# EAGLE design MOTOR SIDE PCB (EAGLE 9.6.2)
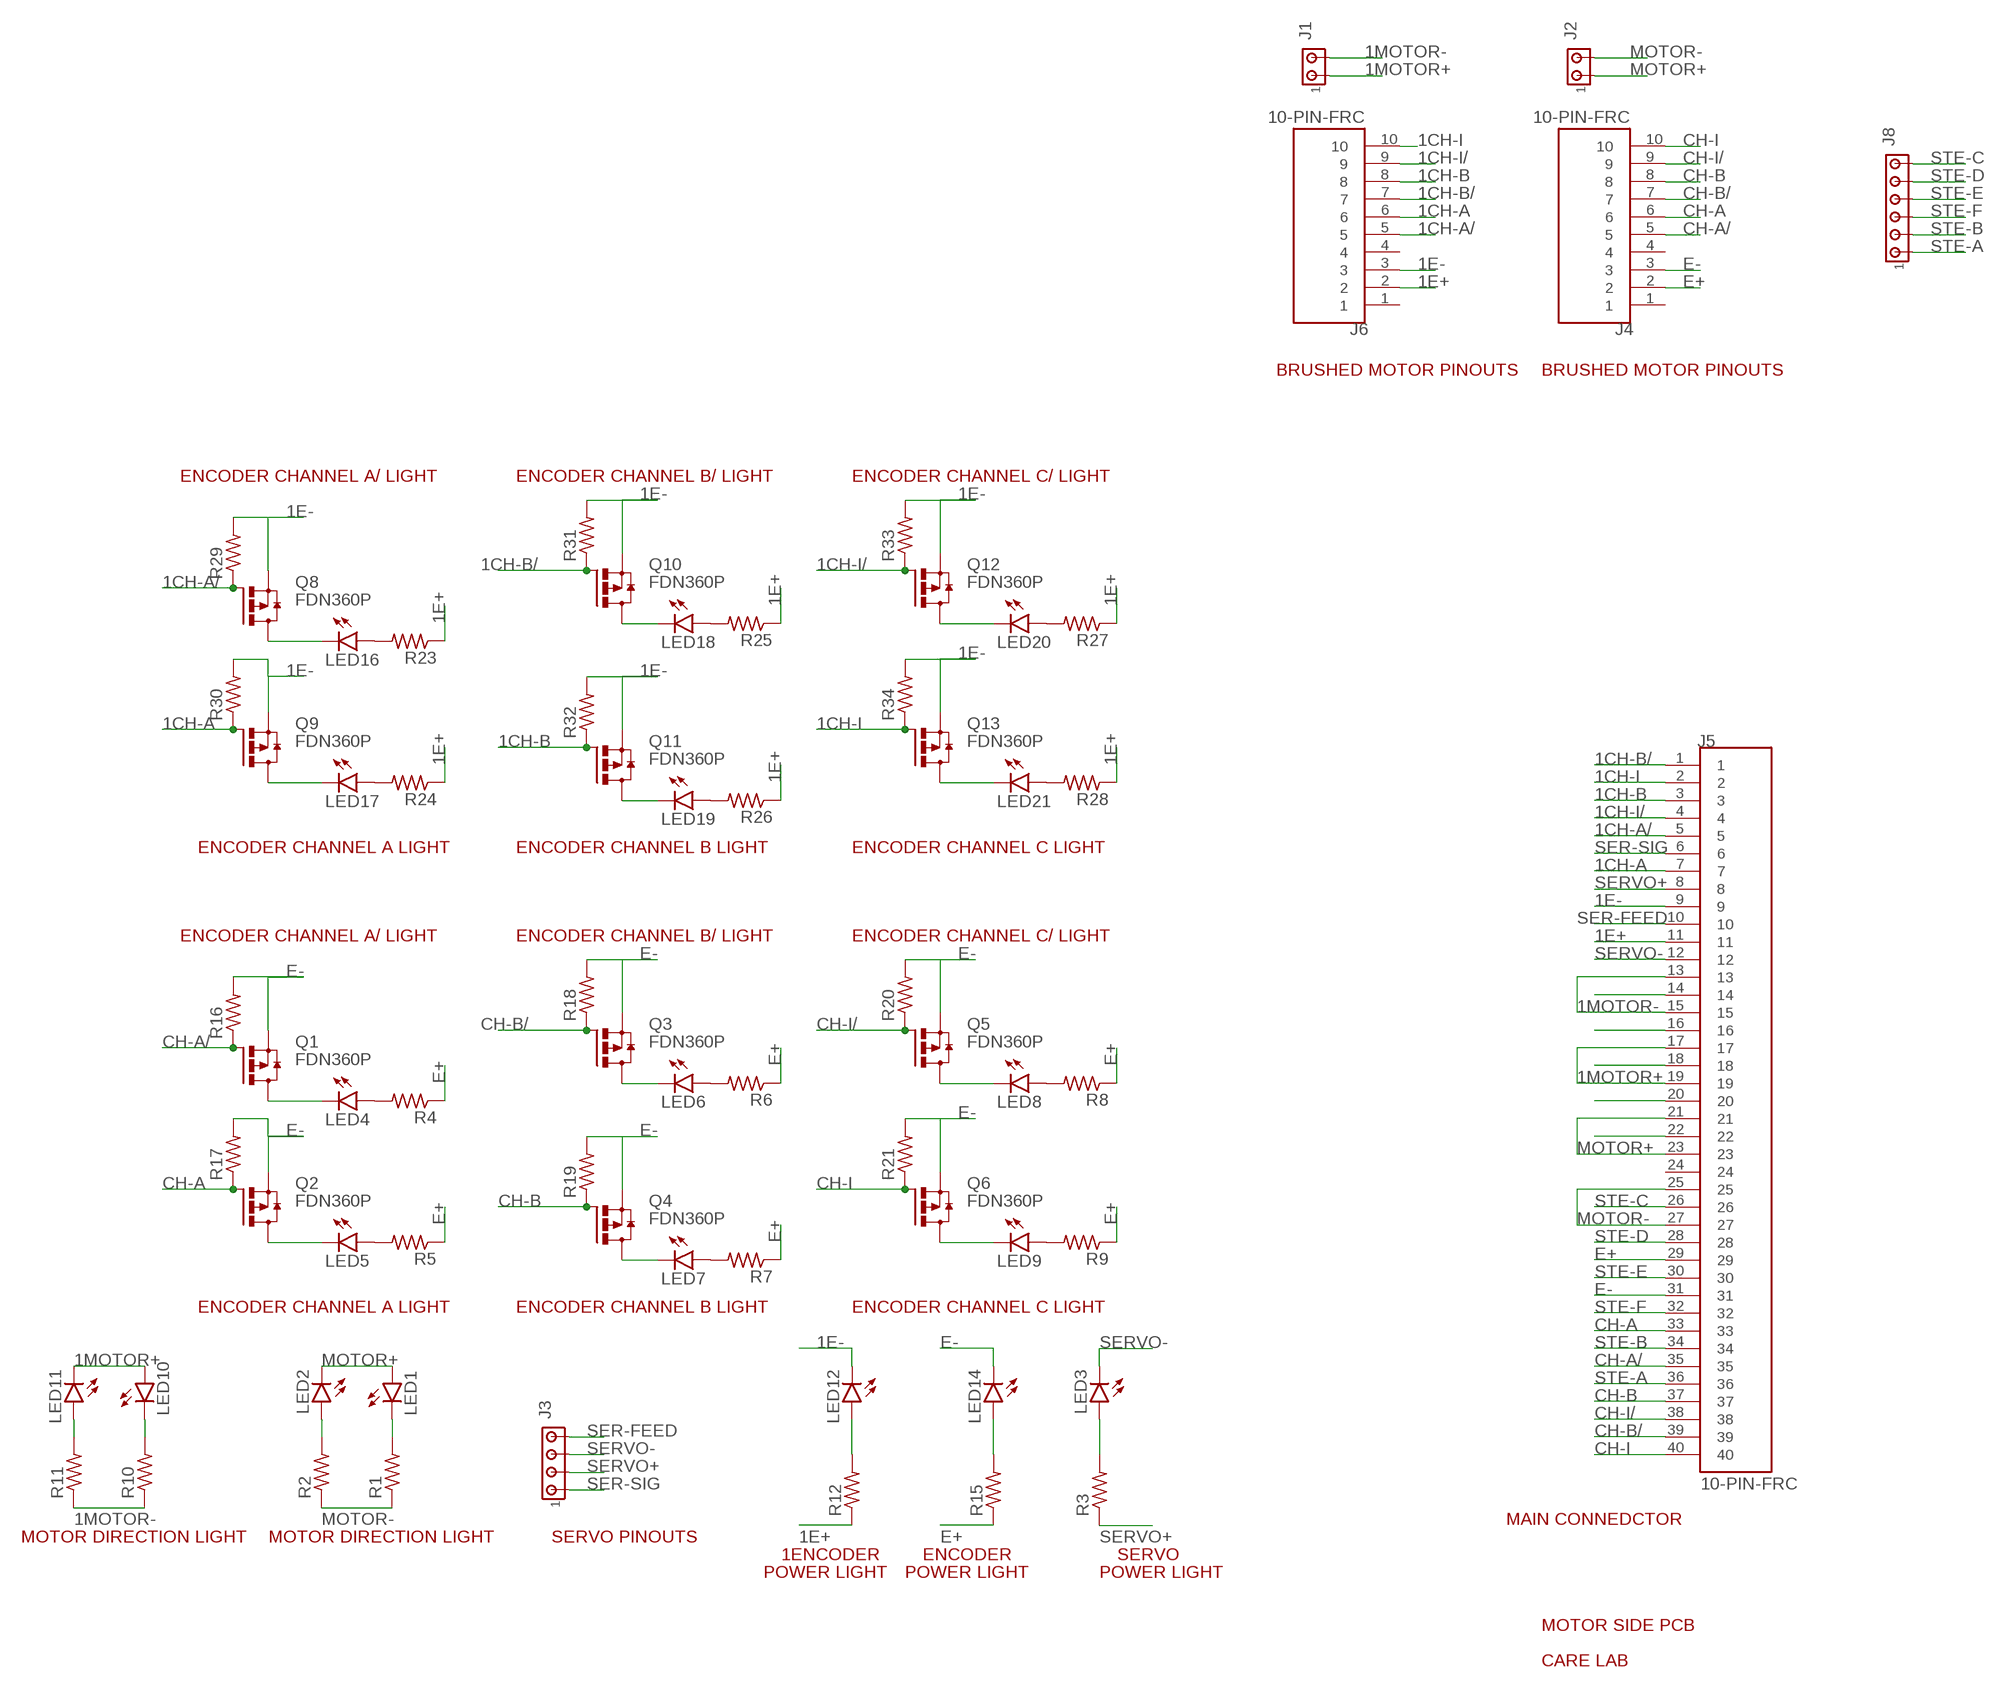
[diagram p0: schematic, sheet 1]

## Parts
J1  MTA02-100  [10X02MTA]
J2  MTA02-100  [10X02MTA]
J3  MTA04-100  [10X04MTA]
J4  10-PIN-FRC  [TE_2-1761603-3]
J5  10-PIN-FRC  [TE_3-1761605-3]
J6  10-PIN-FRC  [TE_2-1761603-3]
J8  MTA06-100  [10X06MTA]
LED1  LEDCHIP-LED0805  [CHIP-LED0805]
LED2  LEDCHIP-LED0805  [CHIP-LED0805]
LED3  LEDCHIP-LED0805  [CHIP-LED0805]
LED4  LEDCHIP-LED0805  [CHIP-LED0805]
LED5  LEDCHIP-LED0805  [CHIP-LED0805]
LED6  LEDCHIP-LED0805  [CHIP-LED0805]
LED7  LEDCHIP-LED0805  [CHIP-LED0805]
LED8  LEDCHIP-LED0805  [CHIP-LED0805]
LED9  LEDCHIP-LED0805  [CHIP-LED0805]
LED10  LEDCHIP-LED0805  [CHIP-LED0805]
LED11  LEDCHIP-LED0805  [CHIP-LED0805]
LED12  LEDCHIP-LED0805  [CHIP-LED0805]
LED14  LEDCHIP-LED0805  [CHIP-LED0805]
LED16  LEDCHIP-LED0805  [CHIP-LED0805]
LED17  LEDCHIP-LED0805  [CHIP-LED0805]
LED18  LEDCHIP-LED0805  [CHIP-LED0805]
LED19  LEDCHIP-LED0805  [CHIP-LED0805]
LED20  LEDCHIP-LED0805  [CHIP-LED0805]
LED21  LEDCHIP-LED0805  [CHIP-LED0805]
Q1  FDN360P  [SUPER-SOT3]
Q2  FDN360P  [SUPER-SOT3]
Q3  FDN360P  [SUPER-SOT3]
Q4  FDN360P  [SUPER-SOT3]
Q5  FDN360P  [SUPER-SOT3]
Q6  FDN360P  [SUPER-SOT3]
Q8  FDN360P  [SUPER-SOT3]
Q9  FDN360P  [SUPER-SOT3]
Q10  FDN360P  [SUPER-SOT3]
Q11  FDN360P  [SUPER-SOT3]
Q12  FDN360P  [SUPER-SOT3]
Q13  FDN360P  [SUPER-SOT3]
R1  R-US_R0603  [R0603]
R2  R-US_R0603  [R0603]
R3  R-US_R0603  [R0603]
R4  R-US_R0603  [R0603]
R5  R-US_R0603  [R0603]
R6  R-US_R0603  [R0603]
R7  R-US_R0603  [R0603]
R8  R-US_R0603  [R0603]
R9  R-US_R0603  [R0603]
R10  R-US_R0603  [R0603]
R11  R-US_R0603  [R0603]
R12  R-US_R0603  [R0603]
R15  R-US_R0603  [R0603]
R16  R-US_R0603  [R0603]
R17  R-US_R0603  [R0603]
R18  R-US_R0603  [R0603]
R19  R-US_R0603  [R0603]
R20  R-US_R0603  [R0603]
R21  R-US_R0603  [R0603]
R23  R-US_R0603  [R0603]
R24  R-US_R0603  [R0603]
R25  R-US_R0603  [R0603]
R26  R-US_R0603  [R0603]
R27  R-US_R0603  [R0603]
R28  R-US_R0603  [R0603]
R29  R-US_R0603  [R0603]
R30  R-US_R0603  [R0603]
R31  R-US_R0603  [R0603]
R32  R-US_R0603  [R0603]
R33  R-US_R0603  [R0603]
R34  R-US_R0603  [R0603]

## Nets
1CH-A: J5.7 J6.6 Q9.1(G) R30.1
1CH-A/: J5.5 J6.5 Q8.1(G) R29.1
1CH-B: J5.3 J6.8 Q11.1(G) R32.1
1CH-B/: J5.1 J6.7 Q10.1(G) R31.1
1CH-I: J5.2 J6.10 Q13.1(G) R34.1
1CH-I/: J5.4 J6.9 Q12.1(G) R33.1
1E+: J5.11 J6.2 R12.1 R23.1 R24.1 R25.1 R26.1 R27.1 R28.1
1E-: J5.9 J6.3 LED12.C Q8.2(S) Q9.2(S) Q10.2(S) Q11.2(S) Q12.2(S) Q13.2(S) R29.2 R30.2 R31.2 R32.2 R33.2 R34.2
1MOTOR+: J1.1 J5.17 J5.19 LED10.A LED11.C
1MOTOR-: J1.2 J5.13 J5.15 R10.1 R11.1
CH-A: J4.6 J5.33 Q2.1(G) R17.1
CH-A/: J4.5 J5.35 Q1.1(G) R16.1
CH-B: J4.8 J5.37 Q4.1(G) R19.1
CH-B/: J4.7 J5.39 Q3.1(G) R18.1
CH-I: J4.10 J5.40 Q6.1(G) R21.1
CH-I/: J4.9 J5.38 Q5.1(G) R20.1
E+: J4.2 J5.29 R4.1 R5.1 R6.1 R7.1 R8.1 R9.1 R15.1
E-: J4.3 J5.31 LED14.C Q1.2(S) Q2.2(S) Q3.2(S) Q4.2(S) Q5.2(S) Q6.2(S) R16.2 R17.2 R18.2 R19.2 R20.2 R21.2
MOTOR+: J2.1 J5.21 J5.23 LED1.A LED2.C
MOTOR-: J2.2 J5.25 J5.27 R1.1 R2.1
N$1: LED4.A R4.2
N$2: LED5.A R5.2
N$3: LED6.A R6.2
N$4: LED7.A R7.2
N$5: LED8.A R8.2
N$6: LED9.A R9.2
N$8: LED2.A R2.2
N$9: LED1.C R1.2
N$10: LED11.A R11.2
N$11: LED10.C R10.2
N$12: LED12.A R12.2
N$15: LED4.C Q1.3(D)
N$16: LED5.C Q2.3(D)
N$17: LED6.C Q3.3(D)
N$18: LED7.C Q4.3(D)
N$19: LED8.C Q5.3(D)
N$20: LED9.C Q6.3(D)
N$24: LED16.C Q8.3(D)
N$25: LED17.C Q9.3(D)
N$26: LED18.C Q10.3(D)
N$27: LED19.C Q11.3(D)
N$28: LED20.C Q12.3(D)
N$29: LED3.A R3.2
N$30: LED14.A R15.2
N$31: LED21.C Q13.3(D)
N$32: LED16.A R23.2
N$33: LED17.A R24.2
N$34: LED18.A R25.2
N$35: LED19.A R26.2
N$36: LED20.A R27.2
N$37: LED21.A R28.2
N$51: J5.14
N$53: J5.16
N$55: J5.18
N$57: J5.20
N$61: J5.22
SER-FEED: J3.4 J5.10
SER-SIG: J3.1 J5.6
SERVO+: J3.2 J5.8 R3.1
SERVO-: J3.3 J5.12 LED3.C
STE-A: J5.36 J8.1
STE-B: J5.34 J8.2
STE-C: J5.26 J8.6
STE-D: J5.28 J8.5
STE-E: J5.30 J8.4
STE-F: J5.32 J8.3
Unconnected: J4.1 J4.4 J5.24 J6.1 J6.4

## Notes on the sheet
- BRUSHED MOTOR PINOUTS | BRUSHED MOTOR PINOUTS
- ENCODER CHANNEL A/ LIGHT | ENCODER CHANNEL B/ LIGHT | ENCODER CHANNEL C/ LIGHT
- ENCODER CHANNEL A LIGHT | ENCODER CHANNEL B LIGHT | ENCODER CHANNEL C LIGHT
- ENCODER CHANNEL A/ LIGHT | ENCODER CHANNEL B/ LIGHT | ENCODER CHANNEL C/ LIGHT
- ENCODER CHANNEL A LIGHT | ENCODER CHANNEL B LIGHT | ENCODER CHANNEL C LIGHT
- MAIN CONNEDCTOR
- MOTOR DIRECTION LIGHT | MOTOR DIRECTION LIGHT | SERVO PINOUTS
- 1ENCODER | ENCODER | SERVO
- POWER LIGHT | POWER LIGHT | POWER LIGHT
- MOTOR SIDE PCB
- CARE LAB

## Library data of the parts
J1 J2 = con-amp:MTA02-100: AMP connector
J3 = con-amp:MTA04-100: AMP connector
J4 J6 = 2-1761603-3:10-PIN-FRC: IDC LOW PRO HDR 20P VERT BLACK Check availability <https://pricing.snapeda.com/parts/2-1761603-3/TE%20Connectivity/view-part?ref=eda>; AVAILABILITY: In Stock; COMMENT: 2-1761603-3; DESCRIPTION: Header, Pin, Idc, Amp-Latch, 10 Pos, Low Profile, Pcb, Vertical, Blue; EU_ROHS_COMPLIANCE: Compliant; MF: TE Connectivity; MP: 2-1761603-3; PACKAGE: None; PRICE: None; PURCHASE-URL: https://pricing.snapeda.com/search/part/2-1761603-3/?ref=eda
J5 = 3-1761605-3:10-PIN-FRC: IDC LOW PRO HDR 10P RA BLACK Check availability <https://pricing.snapeda.com/parts/3-1761605-3/TE%20Connectivity/view-part?ref=eda>; AVAILABILITY: In Stock; COMMENT: 3-1761605-3; DESCRIPTION: IDC LOW PRO HDR 40P RA BLUE; EU_ROHS_COMPLIANCE: Compliant; MF: TE Connectivity; MP: 3-1761605-3; PACKAGE: None; PRICE: None; PURCHASE-URL: https://pricing.snapeda.com/search/part/3-1761605-3/?ref=eda
J8 = con-amp:MTA06-100: AMP connector Connection corrected 2014-09-19
LED1-LED12 LED14 LED16-LED21 = led:LED: LED OSRAM: - CHIPLED LG R971, LG N971, LY N971, LG Q971, LY Q971, LO R971, LY R971 LH N974, LH R974 LS Q976, LO Q976, LY Q976 LO Q996 - Hyper CHIPLED LW Q18S LB Q993, LB Q99A, LB R99A - SideLED LS A670, LO A670, LY A670, LG A670, LP A670 LB A673, LV A673, LT A673, LW A673 LH A674 LY A675 LS A676, LA A676, LO A676, LY A676, LW A676 LS A679, LY A679, LG A679 - Hyper Micro SIDELED® LS Y876, LA Y876, LO Y876, LY Y876 LT Y87S - SmartLED LW L88C, LW L88S LB L89C, LB L89S, LG L890 LS L89K, LO L89K, LY L89K LS L896, LA L896, LO L896, LY L896 - TOPLED LS T670, LO T670, LY T670, LG T670, LP T670 LSG T670, LSP T670, LSY T670, LOP T670, LYG T670 LG T671, LOG T671, LSG T671 LB T673, LV T673, LT T673, LW T673 LH T674 LS T676, LA T676, LO T676, LY T676, LB T676, LH T676, LSB T676, LW T676 LB T67C, LV T67C, LT T67C, LS T67K, LO T67K, LY T67K, LW E67C LS E67B, LA E67B, LO E67B, LY E67B, LB E67C, LV E67C, LT E67C LW T67C LS T679, LY T679, LG T679 LS T770, LO T770, LY T770, LG T770, LP T770 LB T773, LV T773, LT T773, LW T773 LH T774 LS E675, LA E675, LY E675, LS T675 LS T776, LA T776, LO T776, LY T776, LB T776 LHGB T686 LT T68C, LB T68C - Hyper Mini TOPLED® LB M676 - Mini TOPLED Santana® LG M470 LS M47K, LO M47K, LY M47K Source: http://www.osram.convergy.de LUXEON: - LUMILED® LXK2-PW12-R00, LXK2-PW12-S00, LXK2-PW14-U00, LXK2-PW14-V00 LXK2-PM12-R00, LXK2-PM12-S00, LXK2-PM14-U00 LXK2-PE12-Q00, LXK2-PE12-R00, LXK2-PE12-S00, LXK2-PE14-T00, LXK2-PE14-U00 LXK2-PB12-K00, LXK2-PB12-L00, LXK2-PB12-M00, LXK2-PB14-N00, LXK2-PB14-P00, LXK2-PB14-Q00 LXK2-PR12-L00, LXK2-PR12-M00, LXK2-PR14-Q00, LXK2-PR14-R00 LXK2-PD12-Q00, LXK2-PD12-R00, LXK2-PD12-S00 LXK2-PH12-R00, LXK2-PH12-S00 LXK2-PL12-P00, LXK2-PL12-Q00, LXK2-PL12-R00 Source: www.luxeon.com KINGBRIGHT: KA-3528ASYC Source: www.kingbright.com
Q1-Q6 Q8-Q13 = transistor-power:FDN360P: Single P-Channel, PowerTrench (R) MOSFET Source: http://www.fairchildsemi.com/ds/FD/FDN360P.pdf
R1-R12 R15-R21 R23-R34 = rcl:R-US_: RESISTOR, American symbol; SPICEPREFIX: R

## Board
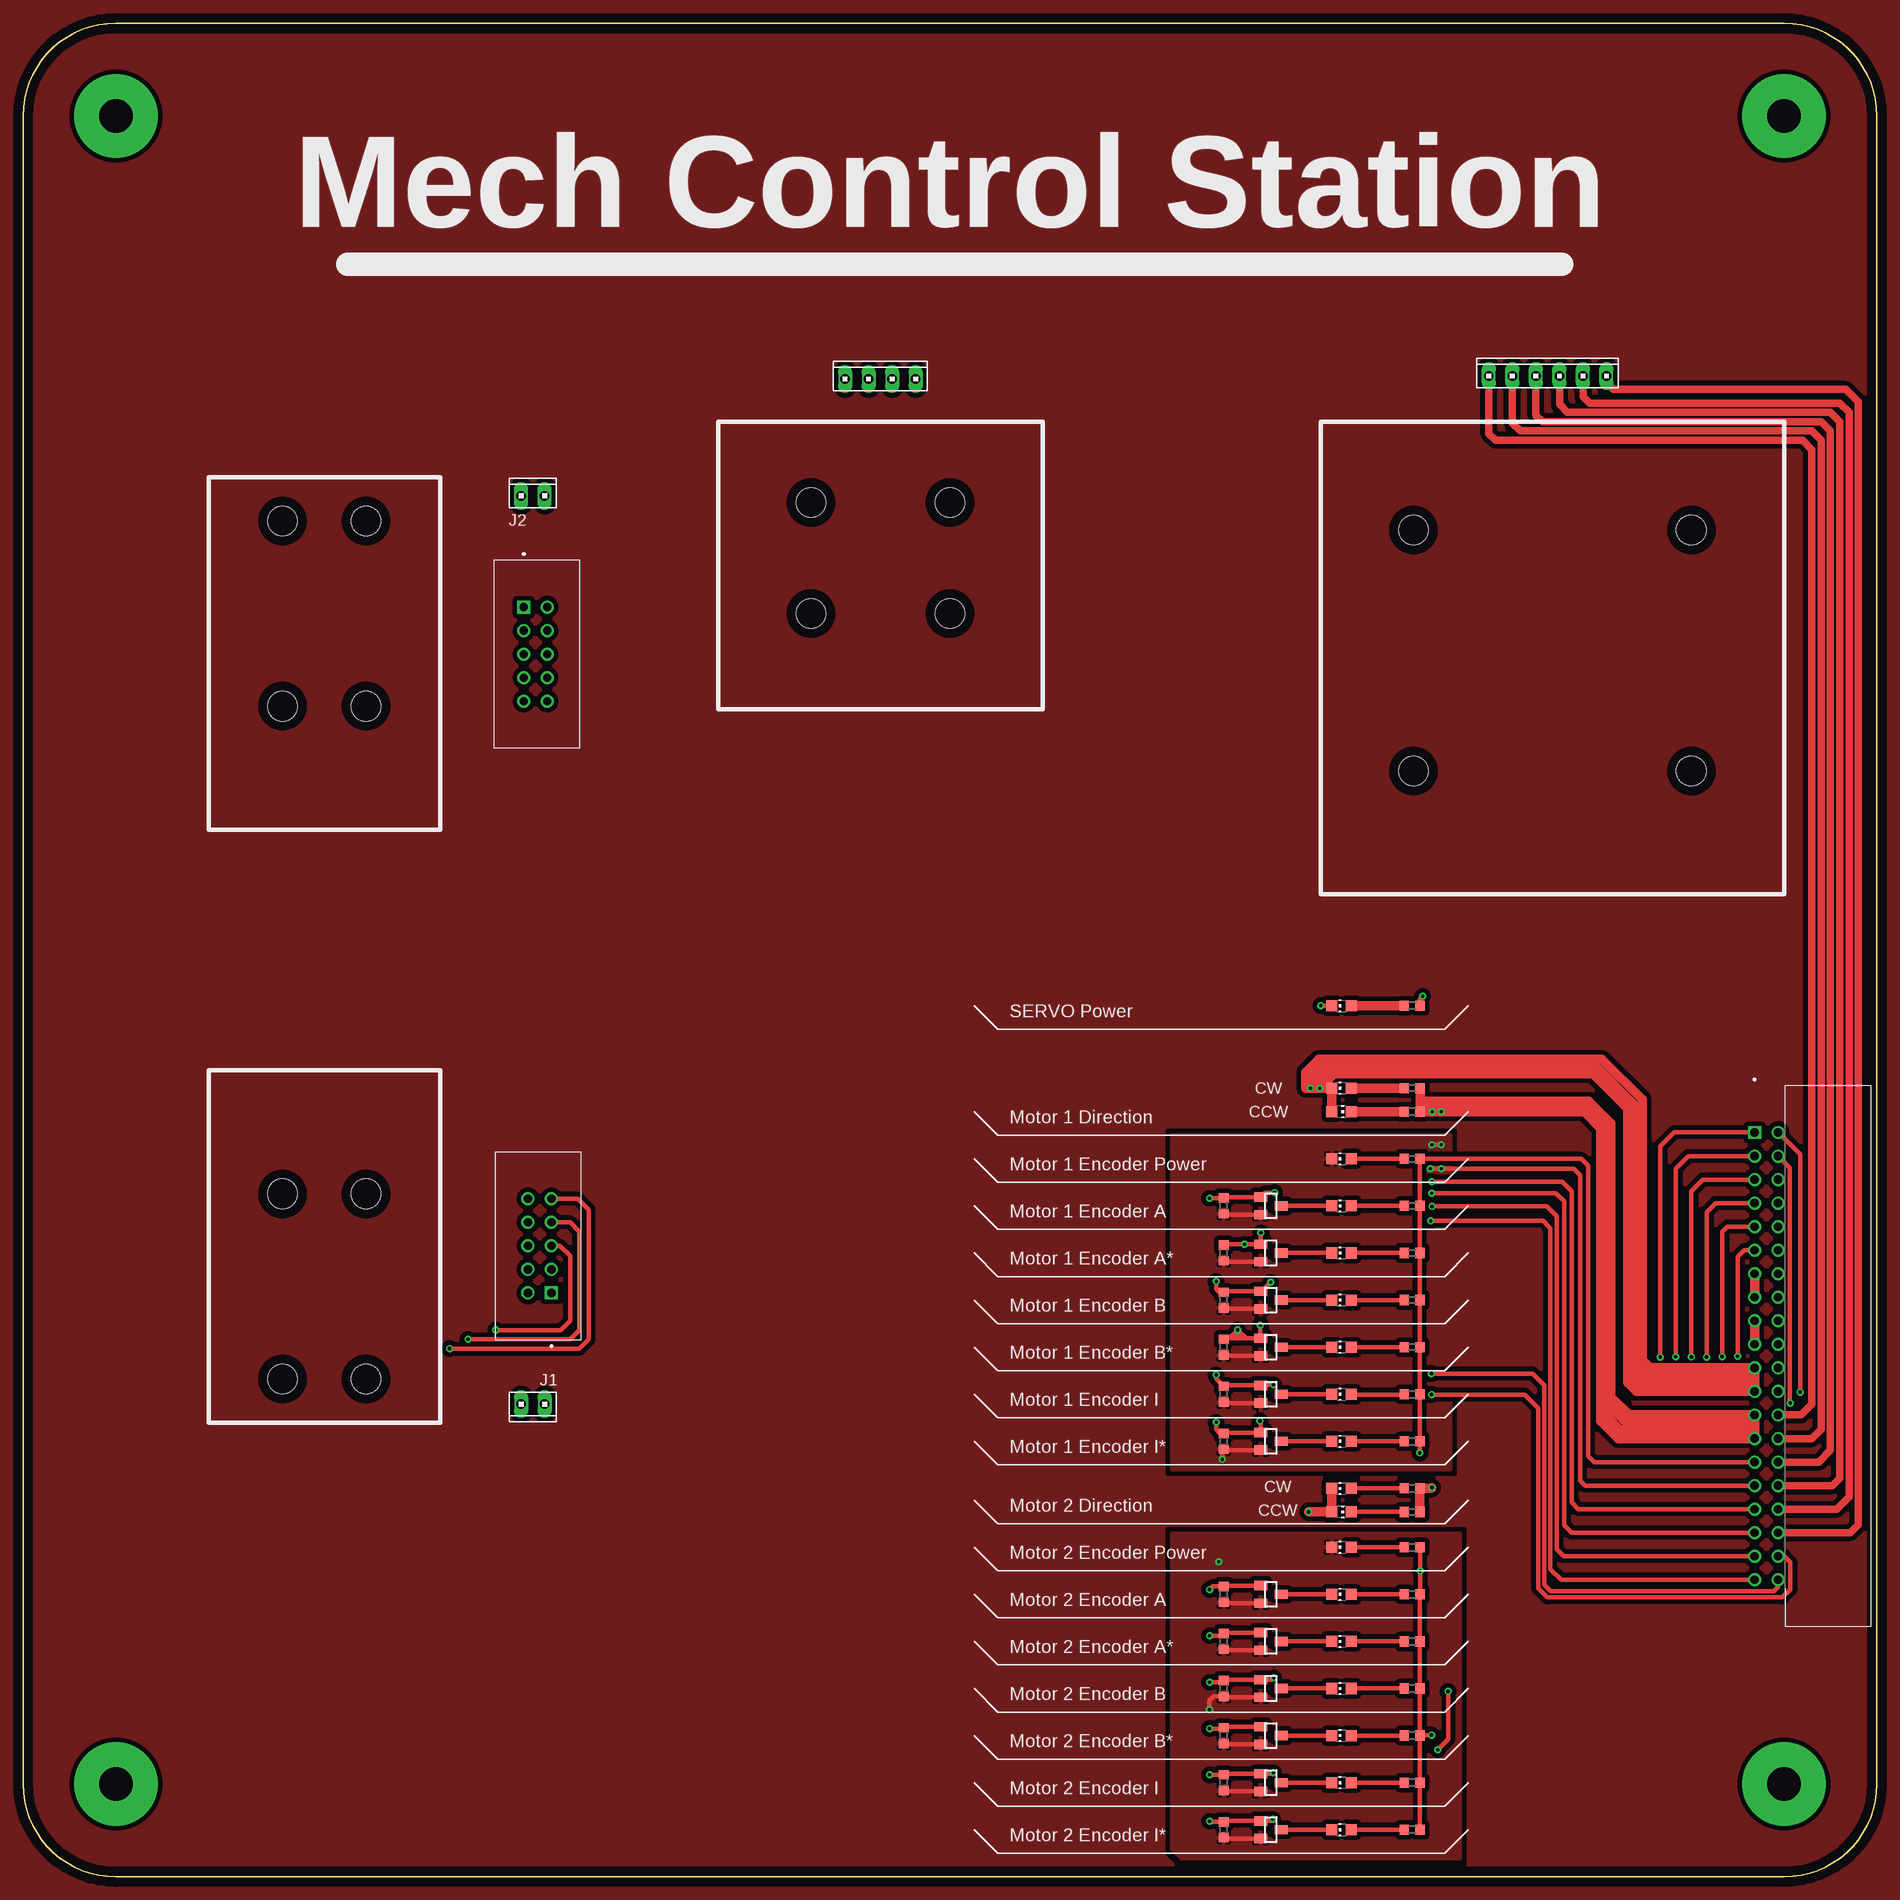
[diagram p1: board, top side]
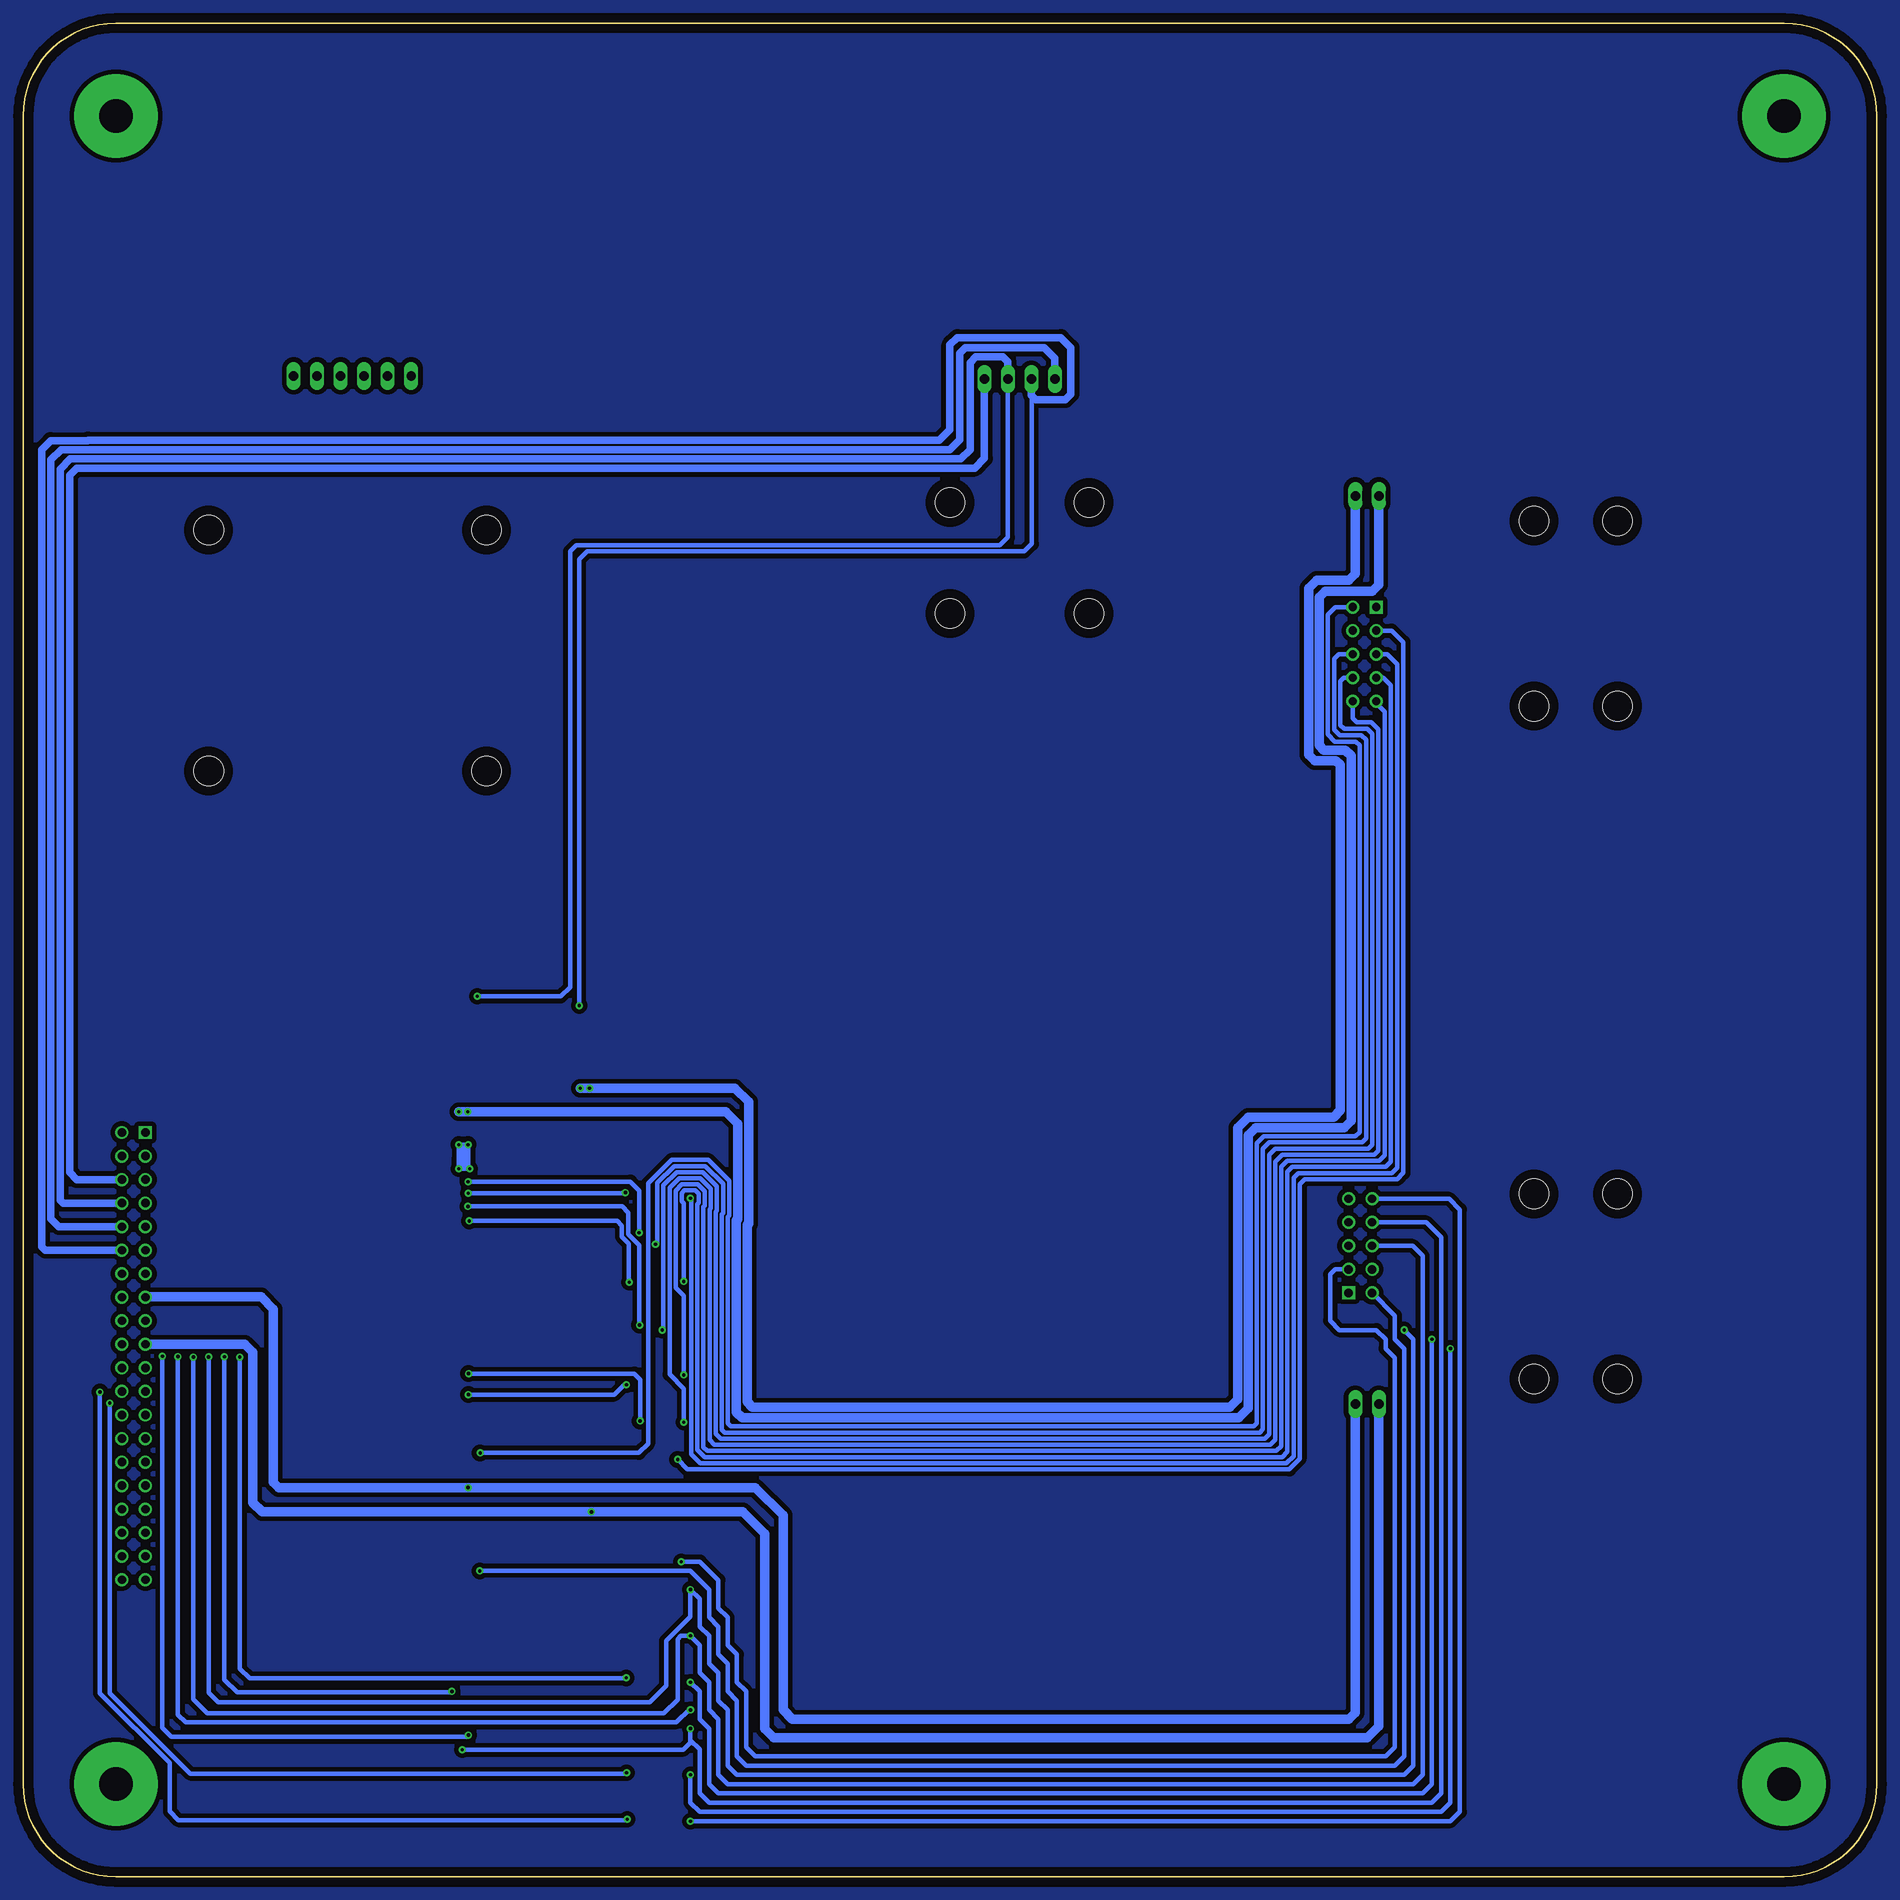
[diagram p2: board, bottom side, seen from below]

Size 200 x 200 mm. Coordinates in mm from the lower left corner, seen from the top.
Outline: 0,10 0,190 arc-90 10,200 190,200 arc-90 200,190 200,10 arc-90 190,0 10,0 arc-90 0,10
Copper layers (1*16): Top 0.035mm / dielectric 1.5mm / Bottom 0.035mm
Design rules "default *": minimum track width 6mil, minimum drill 0.35mm, track to track 6mil, track to pad 6mil, pad to pad 6mil, via to via 6mil, smd to smd 6mil, copper to edge 40mil, drill to drill 6mil, minimum pad ring 10mil, minimum via ring 8mil, stop-mask expansion 4mil, vias tented up to drill 100mil, thermal gap 10mil
Holes 3.2 mm at 28,53.7 37,53.7 37,73.7 28,73.7 28,126.3 37,126.3 37,146.3 28,146.3 85,148.3 85,136.3 100,136.3 100,148.3 150,145.3 179.98,145.3 150,119.3 179.98,119.3

### Footprints (pad centres in the part's own frame; a part is rotated, then mirrored left to right if it is on the bottom)
10X02MTA = drill 1.016 long: 1 1.27,0; 2 -1.27,0
10X04MTA = drill 1.016 long: 1 3.81,0; 2 1.27,0; 3 -1.27,0; 4 -3.81,0
TE_2-1761603-3 = drill 0.89 pad 1.24 square: 1 0,0 | drill 0.89 pad 1.24: 2 0,2.54; 3 2.54,0; 4 2.54,2.54; 5 5.08,0; 6 5.08,2.54; 7 7.62,0; 8 7.62,2.54; 9 10.16,0; 10 10.16,2.54
TE_3-1761605-3 = drill 0.89 pad 1.24 square: 1 0,0 | drill 0.89 pad 1.24: 2 0,2.54; 3 2.54,0; 4 2.54,2.54; 5 5.08,0; 6 5.08,2.54; 7 7.62,0; 8 7.62,2.54; 9 10.16,0; 10 10.16,2.54; 11 12.7,0; 12 12.7,2.54; 13 15.24,0; 14 15.24,2.54; 15 17.78,0; 16 17.78,2.54; 17 20.32,0; 18 20.32,2.54; 19 22.86,0; 20 22.86,2.54; 21 25.4,0; 22 25.4,2.54; 23 27.94,0; 24 27.94,2.54; 25 30.48,0; 26 30.48,2.54; 27 33.02,0; 28 33.02,2.54; 29 35.56,0; 30 35.56,2.54; 31 38.1,0; 32 38.1,2.54; 33 40.64,0; 34 40.64,2.54; 35 43.18,0; 36 43.18,2.54; 37 45.72,0; 38 45.72,2.54; 39 48.26,0; 40 48.26,2.54
10X06MTA = drill 1.016 long: 1 6.35,0; 2 3.81,0; 3 1.27,0; 4 -1.27,0; 5 -3.81,0; 6 -6.35,0
CHIP-LED0805 = smd 1.2 x 1.2: A 0,-1.05; C 0,1.05
SUPER-SOT3 = smd 1 x 1.4: 1 -0.95,-1.1; 2 0.95,-1.1; 3 0,1.1
R0603 = smd 1 x 1.1: 1 -0.85,0; 2 0.85,0

### Placement (x,y rotation side)
J1  55,51 180 top
J2  55,149 0 top
J3  92.49,161.6 0 top
J4  54,137 270 top
J5  186.81,80.31 270 top
J6  57,63 90 top
J8  164.48,161.94 0 top
LED1  142.24,82.55 270 top
LED2  142.24,85.09 90 top
LED3  142.24,93.98 90 top
LED4  142.24,72.39 90 top
LED5  142.24,67.31 90 top
LED6  142.24,62.23 90 top
LED7  142.24,57.15 90 top
LED8  142.24,52.07 90 top
LED9  142.24,46.99 90 top
LED10  142.24,39.37 270 top
LED11  142.24,41.91 90 top
LED12  142.24,35.56 90 top
LED14  142.24,77.47 90 top
LED16  142.24,30.48 90 top
LED17  142.24,25.4 90 top
LED18  142.24,20.32 90 top
LED19  142.24,15.24 90 top
LED20  142.24,10.16 90 top
LED21  142.24,5.08 90 top
Q1  134.62,72.39 270 top
Q2  134.62,67.31 270 top
Q3  134.62,62.23 270 top
Q4  134.62,57.15 270 top
Q5  134.62,52.07 270 top
Q6  134.62,46.99 270 top
Q8  134.62,30.48 270 top
Q9  134.62,25.4 270 top
Q10  134.62,20.32 270 top
Q11  134.62,15.24 270 top
Q12  134.62,10.16 270 top
Q13  134.62,5.08 270 top
R1  149.86,82.55 180 top
R2  149.86,85.09 180 top
R3  149.86,93.98 180 top
R4  149.86,72.39 180 top
R5  149.86,67.31 180 top
R6  149.86,62.23 180 top
R7  149.86,57.15 180 top
R8  149.86,52.07 180 top
R9  149.86,46.99 180 top
R10  149.86,39.37 180 top
R11  149.86,41.91 180 top
R12  149.86,35.56 180 top
R15  149.86,77.47 180 top
R16  129.54,72.39 270 top
R17  129.54,67.31 270 top
R18  129.54,62.23 270 top
R19  129.54,57.15 270 top
R20  129.54,52.07 270 top
R21  129.54,46.99 270 top
R23  149.86,30.48 180 top
R24  149.86,25.4 180 top
R25  149.86,20.32 180 top
R26  149.86,15.24 180 top
R27  149.86,10.16 180 top
R28  149.86,5.08 180 top
R29  129.54,30.48 270 top
R30  129.54,25.4 270 top
R31  129.54,20.32 270 top
R32  129.54,15.24 270 top
R33  129.54,10.16 270 top
R34  129.54,5.08 270 top

### Tracks (layer width: path | path; a pad name or v marks a point on that pad's centre or on a via)
1CH-A  (via drill 0.35)
  Top 0.508: Q9.1 129.64,26.35 R30.1 129.29,26 v128,26 | J5.7 182.6,72.69 181.63,71.72 v181.63,56.08
  Bottom 0.508: J6.6 50.08,68.08 49,67 49,11 50,10 124,10 125,11 125,17 126,18 126,21 127,22 127,25 v128,26 129.04,26 129.39,25.65 129.39,19.13 130.87,17.65 180.12,17.65 181.63,19.16 v181.63,56.08
1CH-A/  (via drill 0.35)
  Top 0.508: Q8.1 129.64,31.43 R29.1 128.33,31.33 v128,31 | J6.5 57.92,68.08 59,67 59,60 58,59 v51,59 | J5.5 181.23,75.23 179.99,73.99 v179.99,56.09
  Bottom 0.508: v51,59 50,58 50,12 51,11 123,11 124,12 124,18 125,19 125,22 126,23 126,26 127,27 127,30 v128,31 128,28.08 130.62,25.46 130.62,20.61 132.4,18.82 178.96,18.82 179.99,19.86 v179.99,56.09
1CH-B  (via drill 0.35)
  Top 0.508: Q11.1 129.64,16.19 R32.1 129.45,16 v128,16 | J5.3 179.66,77.77 178.28,76.39 v178.28,56.11 | v153.74,20 153.74,14.82 v152.63,13.72
  Bottom 0.508: J6.8 48.62,70.62 47,69 47,9 48,8 126,8 127,9 127,13.75 128,14.75 v128,16 128,14.49 128.77,13.72 v152.63,13.72 | v178.28,56.11 178.28,21.29 176.93,19.93 153.74,19.93 v153.74,20
1CH-B/  (via drill 0.35)
  Top 0.508: v128,21 129.37,21 R31.1 129.64,21.27 Q10.1 134.73,21.27 v134.92,21.47 | J6.7 59,70.62 60,69.62 60,59 59,58 v48,58 | J5.1 178.13,80.31 176.62,78.8 v176.62,56.08
  Bottom 0.508: v128,21 127,20 127,17 126,16 126,10 125,9 49,9 48,10 v48,58 | v176.62,56.08 176.62,22.45 175.57,21.41 134.99,21.41 v134.92,21.47
1CH-I  (via drill 0.35)
  Top 0.508: v128,6 128.07,5.93 R34.1 129.64,6.03 Q13.1 134.63,6.03 v134.82,6.21 | J5.2 191.71,77.95 v191.71,52.3
  Bottom 0.508: J6.10 46.16,73.16 45,72 45,7 46,6 v128,6 | v191.71,52.3 191.71,19.81 184.18,12.28 184.18,7.05 183.25,6.12 134.82,6.12 v134.82,6.21
1CH-I/  (via drill 0.35)
  Top 0.508: v128,11 R33.1 129.64,11.11 Q12.1 134.77,11.11 v134.9,11.24 | v46,57 60,57 61,58 61,72 59.84,73.16 J6.9 | J5.4 190.6,76.52 190.6,51.17 v190.65,51.12
  Bottom 0.508: v128,11 128,8 127,7 47,7 46,8 v46,57 | v134.9,11.24 134.9,11.12 181.95,11.12 190.65,19.83 v190.65,51.12
1E+  (via drill 0.35)
  Top 0.508: 150.71,15.3 R25.1 R24.1 R23.1 150.75,30.52 v150.75,33 150.75,35.52 R12.1 | 150.71,15.3 R26.1 R27.1 R28.1 | J5.11 185.7,67.61 184.98,66.88 v184.98,56.18 | v151.96,15.3 150.71,15.3
  Bottom 0.508: J6.2 52,60.54 52,58 51,57 51,13 52,12 122,12 123,13 123,19 124,20 124,23 125,24 125,27 126,28 126,31 128,33 v150.75,33 | v184.98,56.18 184.98,16.09 184.01,15.13 152.13,15.13 v151.96,15.3
1E-  (via drill 0.35)
  Top 0.508: Q8.2 129.64,29.53 R29.2 | Q9.2 129.64,24.45 R30.2 | Q10.2 129.64,19.37 R31.2 128.48,19.47 128,18.99 v128,18 | Q11.2 129.64,14.29 R32.2 | Q12.2 129.64,9.21 R33.2 | Q13.2 129.64,4.13 R34.2 | J5.9 183.87,70.15 183.3,69.58 v183.3,56.14
  Bottom 0.508: J6.3 58.46,65.54 59,65 59,60 58,59 54,59 53,58 53,57 52,56 52,14 53,13 121,13 122,14 122,20 123,21 123,24 124,25 124,28 125,29 125,32 127,34 v129,34 | v183.3,56.14 183.3,17.51 182.48,16.69 129.51,16.69 128.1,18.1 v128,18
  pour Top (isolate 0.5): 126,37 155,37 155,2 125,2 124,3 124,37
1MOTOR+  (via drill 0.35)
  Top 1.016: v138.68,39.37 LED10.A LED11.C | J5.19 J5.17
  Bottom 1.016: J1.1 53.73,16.27 55,15 119,15 120,16 120,37 122.37,39.37 v138.68,39.37 174.23,39.37 175.22,40.36 175.22,56.59 176.08,57.45 J5.19
1MOTOR-  (via drill 0.35)
  Top 1.016: v152,42 151.91,41.91 R11.1 R10.1 | J5.15 J5.13
  Bottom 1.016: J1.2 56.27,17.73 57,17 117,17 118,18 118,39 121,42 v152,42 172.45,42 173.02,42.58 173.02,61.26 174.32,62.56 186.78,62.56 J5.15
BOTTOM
  pour Bottom (isolate 0.5): -21,-22 -21,216 220,216 221,215 221,-21 -19,-21 -20,-22
CH-A  (via drill 0.35)
  Top 0.508: R17.1 129.64,68.26 v131.78,68.26 v131.79,68.25 Q2.1 133.55,68.29 v133.55,69.5 | J5.33 167.81,39.67 167.09,40.39 167.09,73.96 166.04,75 v152,75
  Bottom 0.508: J4.6 58.04,131.92 58.56,131.4 58.56,123.79 57.97,123.19 55.6,123.19 55.1,122.69 55.1,106.59 55.12,106.61 55.12,79.67 55.55,79.23 65.54,79.23 66.24,78.54 66.24,48.28 66.58,47.94 124.31,47.94 124.63,48.26 124.63,71.47 124.49,71.61 124.49,74.8 126.38,76.69 129.76,76.69 131.58,74.87 131.58,68.45 v131.78,68.26 | v152,75 134.5,75 133.55,74.05 v133.55,69.5
CH-A/  (via drill 0.35)
  Top 0.508: 130,73.34 Q1.1 134.01,73.83 v135.02,73.83 | 130,73.34 129.64,73.34 R16.1 | v128,73.21 129.87,73.21 130,73.34 | J5.35 167.06,37.13 166.25,37.95 166.25,72.88 165.36,73.76 v151.98,73.76
  Bottom 0.508: J4.5 52.84,131.92 51.75,130.83 51.75,76.5 52.32,75.93 62.44,75.93 62.93,75.44 62.93,45.39 63.69,44.63 126.96,44.63 127.93,45.61 127.93,73.21 v128,73.21 | v151.98,73.76 135.09,73.76 v135.02,73.83
CH-B  (via drill 0.35)
  Top 0.508: Q4.1 133.5,58.1 | 133.5,58.1 131.94,58.1 | 131.94,58.1 131.76,58.1 | 131.76,58.1 131,58.1 | 131,58.1 130.71,58.1 | 130.71,58.1 130.15,58.1 | R19.1 129.64,58.1 130.15,58.1 | v131.04,59 130.15,58.1 | v131.04,59 131.04,58.15 131,58.1 | v131.04,59 131.04,58.44 130.71,58.1 | v131.04,59 131.04,58.81 131.76,58.1 | v131.04,59 131.94,58.1 | J5.37 166.2,34.59 165.45,35.34 165.45,71.25 164.37,72.33 v152.01,72.33 | v133.5,59.54 133.5,58.1
  Bottom 0.508: J4.8 57.5,129.38 57.88,129 57.88,124.26 57.48,123.86 54.98,123.86 54.44,123.32 54.44,78.99 54.85,78.57 64.9,78.57 65.58,77.89 65.58,47.75 66.05,47.27 124.73,47.27 125.29,47.83 125.29,71.75 125.15,71.88 125.15,74.53 126.66,76.03 129.49,76.03 130.92,74.6 130.92,59.12 v131.04,59 | v152.01,72.33 135.39,72.33 134.73,71.67 134.73,69.34 133.54,68.16 133.54,59.58 v133.5,59.54
CH-B/  (via drill 0.35)
  Top 0.508: v128.71,64.24 128.71,63.42 129.05,63.08 R18.1 129.64,63.18 Q3.1 133.64,63.18 v134.6,64.15 | J5.39 165.94,32.05 164.79,33.2 164.79,69.96 163.99,70.77 v151.88,70.77
  Bottom 0.508: J4.7 53.25,129.38 52.46,128.58 52.46,77.15 53.01,76.59 63.08,76.59 63.59,76.08 63.59,45.85 64.15,45.29 126.49,45.29 127.27,46.08 127.27,72.57 127.13,72.7 127.13,73.71 127.48,74.05 128.66,74.05 128.94,73.78 128.94,72.88 128.71,72.66 v128.71,64.24 | v151.88,70.77 135.93,70.77 135.39,70.23 135.39,69.07 134.65,68.33 134.65,64.19 v134.6,64.15
CH-I  (via drill 0.35)
  Top 0.508: 129.64,47.94 Q6.1 133.52,49.11 v133.44,49.19 | 129.64,47.94 129.07,47.94 128.71,48.3 v128.71,49.04 | 129.64,47.94 R21.1 | J5.40 189.35,31.3 188.87,30.82 164.84,30.82 164.13,31.53 164.13,53.02 162.85,54.3 v151.94,54.3
  Bottom 0.508: J4.10 56.54,125.03 56.11,124.6 54.55,124.6 53.78,123.82 53.78,78.35 54.21,77.91 64.16,77.91 64.92,77.16 64.92,47.15 65.45,46.62 125.43,46.62 125.95,47.14 125.95,72.02 125.81,72.16 125.81,74.26 126.93,75.37 129.21,75.37 130.26,74.33 130.26,54.21 128.71,52.66 v128.71,49.04 | v151.94,54.3 134.06,54.3 133.41,53.64 133.41,49.22 v133.44,49.19
CH-I/  (via drill 0.35)
  Top 0.508: Q5.1 133.26,53.02 | 133.26,53.02 129.64,53.02 R20.1 128.71,53.75 v128.71,54.15 | J5.38 190.01,34.59 190.67,33.93 190.67,31 189.81,30.14 164.45,30.14 163.47,31.12 163.47,50.57 162,52.04 v151.95,52.04 | v134.91,53.1 133.34,53.1 133.26,53.02
  Bottom 0.508: J4.9 54,126.61 53.12,125.73 53.12,77.83 53.69,77.25 63.64,77.25 64.25,76.64 64.25,46.48 64.78,45.95 126.21,45.95 126.61,46.35 126.61,72.29 126.47,72.43 126.47,73.98 127.2,74.71 128.94,74.71 129.6,74.05 129.6,63.57 128.71,62.69 v128.71,54.15 | v151.95,52.04 136.23,52.04 135.04,53.23 135.03,53.23 v134.91,53.1
E+  (via drill 0.35)
  Top 0.508: v150.7,45.74 150.7,46.98 R9.1 R8.1 R7.1 R6.1 R5.1 R4.1 R15.1 168.09,77.47 168.86,76.7 168.86,45.4 169.51,44.75 J5.29
  Bottom 0.508: J4.2 58.41,137 59.23,136.17 59.23,123.25 58.47,122.49 56.22,122.49 55.8,122.07 55.8,80.35 56.26,79.89 66.17,79.89 66.9,79.17 66.9,48.95 67.25,48.6 123.63,48.6 123.97,48.93 123.97,71.2 123.83,71.33 123.83,75.08 126.11,77.35 130.03,77.35 132.56,74.83 132.56,46.75 133.57,45.74 v150.7,45.74
E-  (via drill 0.35)
  Top 0.508: Q6.2 129.64,46.04 | 129.64,46.04 R21.2 | Q5.2 129.64,51.12 R20.2 | Q4.2 129.64,56.2 R19.2 | Q3.2 129.64,61.28 R18.2 | Q2.2 129.64,66.36 R17.2 | Q1.2 129.64,71.44 R16.2 | v129.39,45.04 129.39,45.79 129.64,46.04 | J5.31 168.54,42.21 168,42.75 168,75.69 167.29,76.4 v153,76.4 v151.83,76.4 v151.82,76.39 | v152,79 v153,79
  Bottom 0.508: J4.3 52.34,134.46 51.09,133.21 51.09,75.95 51.77,75.27 61.74,75.27 62.27,74.74 62.27,45.08 63.38,43.97 128.32,43.97 v129.39,45.04 | 152,76.9 152,76.57 v151.82,76.39 v151.83,76.4 v153,76.4 | 152,78.63 152,76.9 | 152,78.63 v152,79 | v152,79 v153,79 | 153,78 153,77.63 | v153,76.4 152.5,76.4 152.41,76.49 | 152.41,76.49 152,76.9 | 152,76.9 152.19,77.09 | 153,77.09 152.19,77.09 | v153,76.4 153,77.09 | v153,79 153,78 | 153,77.63 153,77.09 152.41,76.49 | 153,77.09 153,77.63 | 153,77.63 152.85,77.78 | 152.43,78.2 152,78.63 | 152.19,77.09 152.19,77.63 | 152.19,77.63 152.19,77.97 152.43,78.2 | 152.19,77.09 152.85,77.75 152.85,77.78 | 152.85,77.78 152.43,78.2 | 152.85,77.78 152.34,77.78 152.19,77.63 | 152.43,78.43 152.43,78.2 | 152.43,78.43 v153,79 | v152,79 152.43,78.57 152.43,78.43 | 153,78 152.57,78.43 152.43,78.43
  pour Top (isolate 0.5): 125,80 154,80 154,44 124,44 124,80
MOTOR+  (via drill 0.35)
  Top 1.016: v139.89,85.09 LED2.C | LED2.C | LED2.C LED1.A | J5.23 J5.21 175.56,54.91 174.66,55.8 174.66,56.81 | J5.23 174.05,52.37 173.12,53.3 173.12,82.88 169.35,86.65 141.45,86.65 v139.89,85.09 | 174.66,56.81 174.66,83.88 170.34,88.2 139.77,88.2 138.37,86.8 138.37,85.1 138.38,85.09 v139.89,85.09 | J5.23 186.06,53.12 186.06,54 185.86,54.2 175.06,54.2 175.06,53.18 185.66,53.18 185.66,53.55 174.41,53.55 174.37,53.5 174.37,53.03 173.87,53.03 173.87,54.92 174.71,54.92 174.71,54.15 173.77,54.15 173.77,56.95 174.14,57.33 | 174.14,57.33 | 174.14,57.33 174.5,56.97 174.5,55.85 173.89,55.24 173.89,56.04 174.66,56.81 | 174.14,57.33 173.94,57.53 173.94,83.2 169.72,87.42 140.87,87.42 139.31,85.86 139.01,85.86 139.01,86.7 139.85,87.54 140.3,87.54 | v138.89,85.08 138.9,85.09 v139.89,85.09
  Bottom 1.016: J2.1 56.26,148.99 56.26,140.57 56.95,139.88 60.45,139.88 61.32,139.01 61.32,121.06 60.66,120.41 58.35,120.41 57.92,119.97 57.92,85.75 57.88,85.71 57.88,82.7 58.61,81.98 67.84,81.98 68.98,80.84 68.98,51.51 69.81,50.68 121.31,50.68 121.88,51.25 121.88,70.34 121.74,70.48 121.74,83.62 123.22,85.09 v139.89,85.09
MOTOR-  (via drill 0.35)
  Top 1.016: 150.72,82.54 v152.04,82.54 v153,82.54 168.42,82.54 | 150.72,82.54 R1.1 151.34,83.17 167.79,83.17 168.42,82.54 | R2.1 150.72,85.08 150.72,83.38 | 150.72,83.38 150.72,82.54 | 168.42,82.54 170.22,80.74 170.22,49.17 172.1,47.29 J5.27 J5.25 173.28,49.83 171.31,51.8 171.31,81.29 | 150.72,83.38 151.04,83.7 168.9,83.7 171.31,81.29 | 171.31,81.29 170.51,81.29 168.65,83.14 | 171.31,81.29 170.74,80.71 170.74,52.33 170.96,52.11 170.96,49.58 172.28,48.26 186.13,48.26 186.28,48.1 186.71,48.53 | 186.71,48.53 | 171.4,50.56 171.4,50.53 172.69,49.24 186,49.24 186.71,48.53
  Bottom 1.016: J2.2 53.73,139.4 54.44,138.69 59.53,138.69 60.15,138.07 60.15,122.06 59.66,121.58 57.35,121.58 56.72,120.94 56.72,81.58 57.49,80.81 67.01,80.81 67.81,80.01 67.81,50.55 68.85,49.51 122.42,49.51 123.05,50.14 123.05,70.82 122.92,70.96 122.92,79.84 122.91,79.85 122.91,81.26 124.19,82.54 v152.04,82.54 v153,82.54
N$1
  Top 0.508: LED4.A R4.2
N$2
  Top 0.508: R5.2 LED5.A
N$3
  Top 0.508: R6.2 LED6.A
N$4
  Top 0.508: R7.2 LED7.A
N$5
  Top 0.508: R8.2 148.94,52 143.36,52 LED8.A
N$6
  Top 0.508: R9.2 LED9.A
N$8
  Top 1.016: R2.2 LED2.A
N$9
  Top 1.016: LED1.C R1.2
N$10
  Top 0.508: R11.2 LED11.A
N$11
  Top 0.508: R10.2 LED10.C
N$12
  Top 0.508: R12.2 LED12.A
N$13  (via drill 3.6 pad 9)
  other vias: 10,190
N$15
  Top 0.508: LED4.C Q1.3
N$16
  Top 0.508: LED5.C Q2.3
N$17
  Top 0.508: LED6.C Q3.3
N$18
  Top 0.508: LED7.C Q4.3
N$19
  Top 0.508: LED8.C Q5.3
N$20
  Top 0.508: LED9.C Q6.3
N$22  (via drill 3.6 pad 9)
  other vias: 190,190
N$23  (via drill 3.6 pad 9)
  other vias: 190,10
N$24
  Top 0.508: LED16.C Q8.3
N$25
  Top 0.508: LED17.C Q9.3
N$26
  Top 0.508: LED18.C Q10.3
N$27
  Top 0.508: LED19.C Q11.3
N$28
  Top 0.508: LED20.C Q12.3
N$29
  Top 1.016: R3.2 LED3.A
N$30
  Top 0.508: R15.2 LED14.A
N$31
  Top 0.508: LED21.C Q13.3
N$32
  Top 0.508: R23.2 LED16.A
N$33
  Top 0.508: R24.2 LED17.A
N$34
  Top 0.508: R25.2 LED18.A
N$35
  Top 0.508: R26.2 LED19.A
N$36
  Top 0.508: R27.2 LED20.A
N$37
  Top 0.508: R28.2 LED21.A
N$38  (via drill 3.6 pad 9)
  other vias: 10,10
SER-FEED
  Bottom 0.813: J5.10 196.15,70.15 197,71 197,152.91 195.91,154 100.04,154 98.97,155.08 98.97,164.37 98.34,165 89.84,165 88.68,163.84 J3.4
SER-SIG
  Bottom 0.813: J5.6 194.23,75.23 195,76 195,151.2 194.2,152 97.36,152 96.3,153.06 J3.1
SERVO+  (via drill 0.35)
  Top 0.508: R3.1 150.71,94.71 v151,95
  Bottom 0.508: J3.2 93.76,144.52 94.62,143.66 140.34,143.66 141,143 141,96 142,95 v151,95
  Bottom 0.813: J5.8 195.69,72.69 196,73 196,151.89 194.89,153 98.83,153 97.84,153.99 97.84,163.38 97.21,164 94.31,164 93.76,163.45 J3.2
SERVO-  (via drill 0.35)
  Top 0.508: LED3.C 140.02,93.98 v140,94
  Bottom 0.508: v140,94 140,142.15 139.15,143 92,143 91.17,143.83 91.17,161.55 J3.3
  Bottom 0.813: J5.12 197.61,67.61 198,68 198,154 197.03,154.97 193.03,154.97 193,155 101.15,155 100,156.15 100,165.28 99.2,166.08 88.04,166.08 86.95,164.99 86.95,159.99 87.55,159.39 90.73,159.39 91.22,159.88 J3.3
STE-A
  Top 0.813: J5.36 197.13,37.13 198,38 198,159.14 196.64,160.49 171.54,160.49 170.83,161.2 J8.1
STE-B
  Top 0.813: J5.34 195.67,39.67 197,41 197,158 196,159 169,159 168.3,159.7 168.3,161.93 J8.2
STE-C
  Top 0.813: J5.26 191.83,49.83 193,51 193,154 192,155 158.86,155 158.13,155.73 J8.6
STE-D
  Top 0.813: J5.28 193,47.29 194,48.29 194,155 193,156 161.5,156 160.67,156.83 J8.5
STE-E
  Top 0.813: J5.30 193.75,44.75 195,46 195,156 194,157 163.93,157 163.21,157.72 J8.4
STE-F
  Top 0.813: J5.32 195.21,42.21 196,43 196,157 194.97,158.03 166.6,158.03 165.77,158.86 165.77,161.96 J8.3
TOP
  pour Top (isolate 0.5, rank 5): -12,-5 -12,206 208,206 208,-6 -12,-6

### Text on the board
tPlace: Mech Control Station | SERVO Power | CW | CCW | Motor 1 Direction | Motor 1 Encoder Power | Motor 1 Encoder A | Motor 1 Encoder A* | Motor 1 Encoder B | Motor 1 Encoder B* | Motor 1 Encoder I | Motor 1 Encoder I* | CW | CCW | Motor 2 Direction | Motor 2 Encoder Power | Motor 2 Encoder A | Motor 2 Encoder A* | Motor 2 Encoder B | Motor 2 Encoder B* | Motor 2 Encoder I | Motor 2 Encoder I*